# Altium project ECGHLSound_Layout_V2.PrjPcb
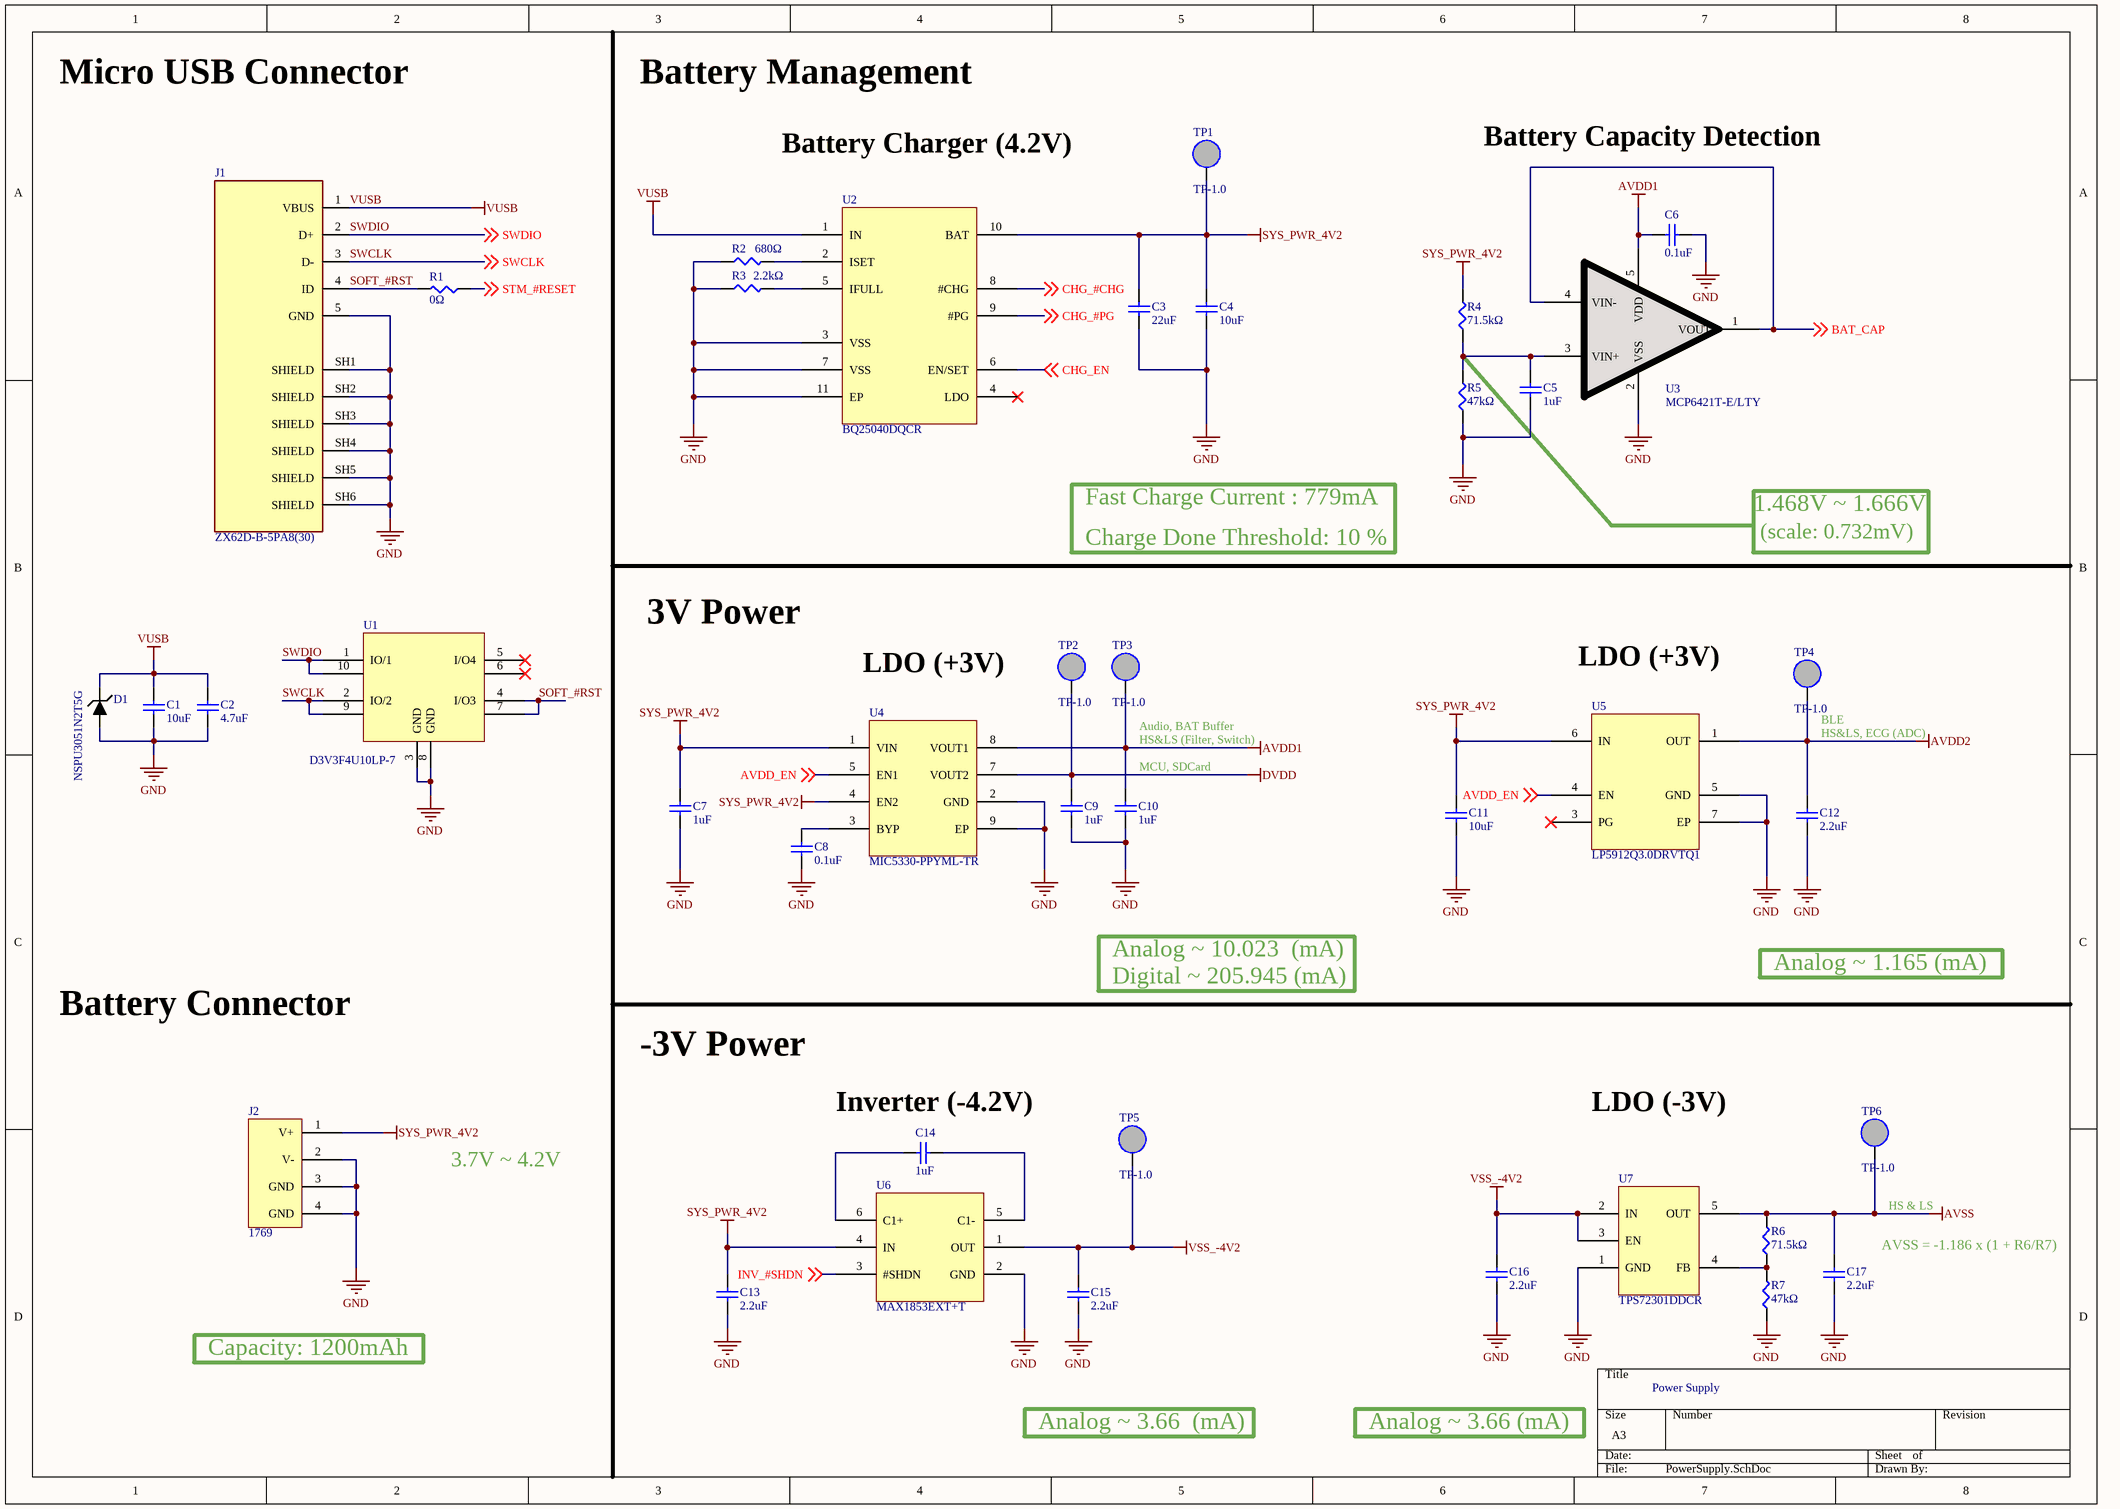
[diagram p0: PowerSupply.SchDoc]
7 sheets, 184 parts. Net scope: flat (ports and power ports of the same name join across sheets).
Board file: ECG_HS_LS.PcbDoc
Sheets:
  PowerSupply.SchDoc
  HeartSound_LungSound.SchDoc
  Audio.SchDoc
  ECG.SchDoc
  Microcontroller.SchDoc
  Peripherals.SchDoc
  Module.SchDoc

## Sheet PowerSupply.SchDoc
size A3; SheetNumber: 1; SheetTotal: 7

### Parts
C1  10uF  [0603]
C2  4.7uF  [0603]
C3  22uF  [0603]
C4  10uF  [0603]
C5  1uF  [0402]
C6  0.1uF  [0402]
C7  1uF  [0402]
C8  0.1uF  [0402]
C9  1uF  [0402]
C10  1uF  [0402]
C11  10uF  [0603]
C12  2.2uF  [0402]
C13  2.2uF  [0402]
C14  1uF  [0402]
C15  2.2uF  [0402]
C16  2.2uF  [0402]
C17  2.2uF  [0402]
D1  NSPU3051N2T5G  [X2DFN-2(0.73-0.6x1.0x0.37)]
J1  ZX62D-B-5PA8(30)  [HIROSE_ZX62D-B-5PA8(30)]
J2  1769  [JST-PH 2-Pin]
R1  0Ω  [0402]
R2  680Ω  [0402]
R3  2.2kΩ  [0402]
R4  71.5kΩ  [0402]
R5  47kΩ  [0402]
R6  71.5kΩ  [0402]
R7  47kΩ  [0402]
TP1  TP-1.0  [Testpoint]  (no BOM)
TP2  TP-1.0  [Testpoint]  (no BOM)
TP3  TP-1.0  [Testpoint]  (no BOM)
TP4  TP-1.0  [Testpoint]  (no BOM)
TP5  TP-1.0  [Testpoint]  (no BOM)
TP6  TP-1.0  [Testpoint]  (no BOM)
U1  D3V3F4U10LP-7  [UDFN2510-10(0.5-1.0x2.5x0.575)]
U2  BQ25040DQCR  [WSON-10(0.5-2.0x3.0x0.8)]
U3  MCP6421T-E/LTY  [SC-70-5]
U4  MIC5330-PPYML-TR  [VFDFN-8]
U5  LP5912Q3.0DRVTQ1  [WSON-6]
U6  MAX1853EXT+T  [SC70-6]
U7  TPS72301DDCR  [SOT-23-5]

### Nets
AVDD1: C6.2 C10.2 TP3.1 U3.5(VDD) U4.8(VOUT1)
AVDD2: C12.2 TP4.1 U5.1(OUT)
AVSS: C17.2 R6.2 TP6.1 U7.5(OUT)
DVDD: C9.2 TP2.1 U4.7(VOUT2)
GND: C1.1 C2.1 C3.1 C4.1 C5.1 C6.1 C7.1 C8.1 C9.1 C10.1 C11.1 C12.1 C13.1 C15.1 C16.1 C17.1 D1.2(ANODE) J1.5(GND) J1.SH1(SHIELD) J1.SH2(SHIELD) J1.SH3(SHIELD) J1.SH4(SHIELD) J1.SH5(SHIELD) J1.SH6(SHIELD) J2.2(V-) J2.3(GND) J2.4(GND) R2.1 R3.1 R5.1 R7.1 U1.3(GND) U1.8(GND) U2.3(VSS) U2.7(VSS) U2.11(EP) U3.2(VSS) U4.2(GND) U4.9(EP) U5.5(GND) U5.7(EP) U6.2(GND) U7.1(GND)
SYS_PWR_4V2: C3.2 C4.2 C7.2 C11.2 C13.2 J2.1(V+) R4.2 TP1.1 U2.10(BAT) U4.1(VIN) U4.4(EN2) U5.6(IN) U6.4(IN)
VSS_-4V2: C15.2 C16.2 TP5.1 U6.1(OUT) U7.2(IN) U7.3(EN)
VUSB: C1.2 C2.2 D1.1(CATHODE) J1.1(VBUS) U2.1(IN)
AVDD_EN: U4.5(EN1) U5.4(EN) ; off-sheet AVDD_EN
BAT_CAP: U3.1(VOUT) U3.4(VIN-) ; off-sheet BAT_CAP
CHG_#CHG: U2.8(#CHG) ; off-sheet CHG_#CHG
CHG_#PG: U2.9(#PG) ; off-sheet CHG_#PG
CHG_EN: U2.6(EN/SET) ; off-sheet CHG_EN
INV_#SHDN: U6.3(#SHDN) ; off-sheet INV_#SHDN
SOFT_#RST: J1.4(ID) R1.2 U1.4(I/O3) U1.7
STM_#RESET: R1.1 ; off-sheet STM_#RESET
SWCLK: J1.3(D-) U1.2(IO/2) U1.9 ; off-sheet SWCLK
SWDIO: J1.2(D+) U1.1(IO/1) U1.10 ; off-sheet SWDIO
NetC5_2: C5.2 R4.1 R5.2 U3.3(VIN+)
NetC8_2: C8.2 U4.3(BYP)
NetC14_1: C14.1 U6.6(C1+)
NetC14_2: C14.2 U6.5(C1-)
NetR2_2: R2.2 U2.2(ISET)
NetR3_2: R3.2 U2.5(IFULL)
NetR6_1: R6.1 R7.2 U7.4(FB)

Not connected (* = marked no-connect by the designer): U1 5(I/O4)* 6*; U2 4(LDO)*; U5 3(PG)*

### Notes on the sheet
- Micro USB Connector
- Battery Management
- Battery Charger (4.2V)
- Battery Capacity Detection
- Fast Charge Current : 779mA
- 1.468V ~ 1.666V
- Charge Done Threshold: 10 %
- (scale: 0.732mV)
- 3V Power
- LDO (+3V)
- (near TP4) BLE
- (near TP3) Audio, BAT Buffer
- (near C10) MCU, SDCard
- HS&LS (Filter, Switch)
- (near TP4) HS&LS, ECG (ADC)
- Digital ~ 205.945 (mA)
- Analog ~ 10.023  (mA)
- Analog ~ 1.165 (mA)
- Battery Connector
- -3V Power
- (near C14) Inverter (-4.2V)
- LDO (-3V)
- 3.7V ~ 4.2V
- (near C17) AVSS = -1.186 x (1 + R6/R7)
- HS & LS
- Capacity: 1200mAh
- Power Supply
- Analog ~ 3.66  (mA)
- Analog ~ 3.66 (mA)

### Library data of the parts
C1-C4 C11 = 0603: MLCC-0603
C5-C10 C12-C17 = 0402: MLCC-0402
D1 = NSPU3051N2T5G: 0016-11-ESD-01-D3V3F4U10LP-7; AuthorBy: yjlab
J1 = ZX62D-B-5PA8(30): USB Connectors 5P RECEPTACLE
J2 = 1769: Battery Connector, JST-PH 2 Pin
R1-R7 = 0402: Resistor_SMD_0402; AuthorBy: yjlab
TP1-TP6 = Testpoint
U1 = D3V3F4U10LP-7: 0017-11-ESD-01-D3V3F4U10LP-7; AuthorBy: yjlab
U2 = BQ25040DQCR: 0001-07-BAC-01-BQ25040DQCR; AuthorBy: yjlab
U3 = MCP6421T-E/LTY: 4.4 µA/Amplifier, 90 kHz Op Amp
U4 = MIC5330-PPYML-TR: Voltage Regulators Dual 300mA LDO, 2 Output: (3V, 3V)
U5 = LP5912Q3.0DRVTQ1: LDO Voltage Regulators Automotive 500-mA, low-noise, low-IQ, low-dropout voltage regulator with reverse current protection
U6 = MAX1853EXT+T: Switching Voltage Regulators SC70 Inverting Charge Pumps with Shutdown, Switching Frequency 200kHz
U7 = TPS72301DDCR: Negative Output LDO, Adjustable Output

## Sheet HeartSound_LungSound.SchDoc
size A3; SheetNumber: 2; SheetTotal: 7
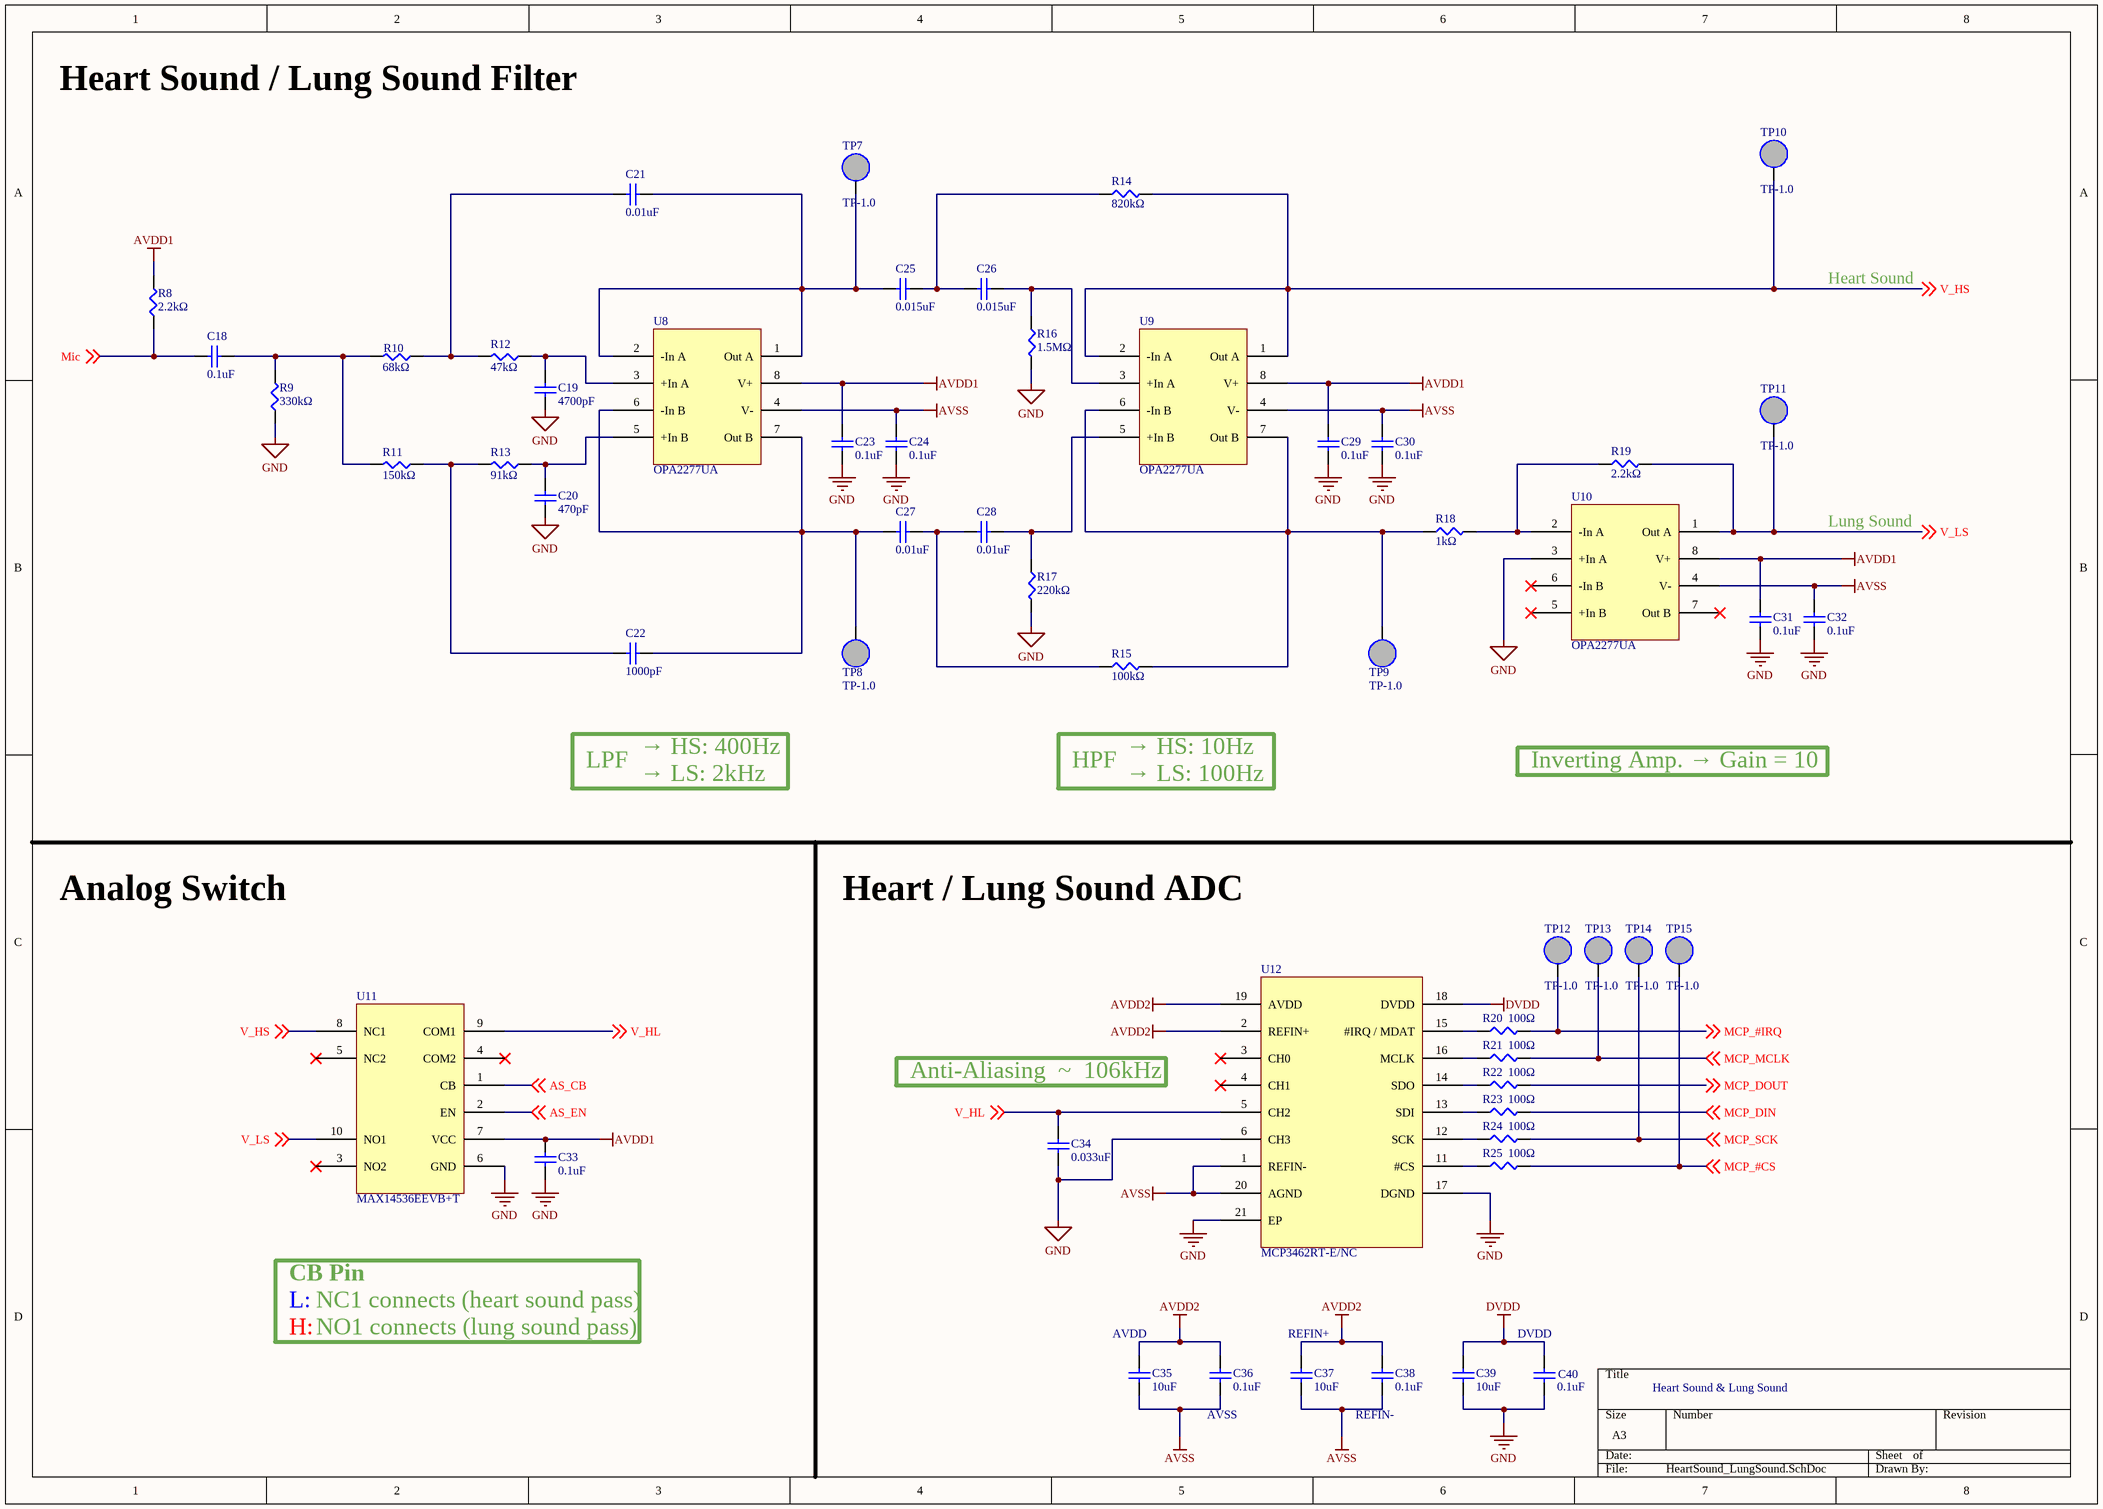
[diagram p1: HeartSound_LungSound.SchDoc]

### Parts
C18  0.1uF  [0402]
C19  4700pF  [0402]
C20  470pF  [0402]
C21  0.01uF  [0402]
C22  1000pF  [0402]
C23  0.1uF  [0402]
C24  0.1uF  [0402]
C25  0.015uF  [0402]
C26  0.015uF  [0402]
C27  0.01uF  [0402]
C28  0.01uF  [0402]
C29  0.1uF  [0402]
C30  0.1uF  [0402]
C31  0.1uF  [0402]
C32  0.1uF  [0402]
C33  0.1uF  [0402]
C34  0.033uF  [0402]
C35  10uF  [0603]
C36  0.1uF  [0402]
C37  10uF  [0603]
C38  0.1uF  [0402]
C39  10uF  [0603]
C40  0.1uF  [0402]
R8  2.2kΩ  [0402]
R9  330kΩ  [0402]
R10  68kΩ  [0402]
R11  150kΩ  [0402]
R12  47kΩ  [0402]
R13  91kΩ  [0402]
R14  820kΩ  [0402]
R15  100kΩ  [0402]
R16  1.5MΩ  [0402]
R17  220kΩ  [0402]
R18  1kΩ  [0402]
R19  2.2kΩ  [0402]
R20  100Ω  [0402]
R21  100Ω  [0402]
R22  100Ω  [0402]
R23  100Ω  [0402]
R24  100Ω  [0402]
R25  100Ω  [0402]
TP7  TP-1.0  [Testpoint]  (no BOM)
TP8  TP-1.0  [Testpoint]  (no BOM)
TP9  TP-1.0  [Testpoint]  (no BOM)
TP10  TP-1.0  [Testpoint]  (no BOM)
TP11  TP-1.0  [Testpoint]  (no BOM)
TP12  TP-1.0  [Testpoint]  (no BOM)
TP13  TP-1.0  [Testpoint]  (no BOM)
TP14  TP-1.0  [Testpoint]  (no BOM)
TP15  TP-1.0  [Testpoint]  (no BOM)
U8  OPA2277UA  [SOIC-8]
U9  OPA2277UA  [SOIC-8]
U10  OPA2277UA  [SOIC-8]
U11  MAX14536EEVB+T  [ULTRA-TQFN-10]
U12  MCP3462RT-E/NC  [UQFN-20]

### Nets
AVDD1: C23.1 C29.2 C31.2 C33.2 R8.2 U8.8(V+) U9.8(V+) U10.8(V+) U11.7(VCC)
AVDD2: C35.2 C36.2 C37.1 C38.2 U12.2(REFIN+) U12.19(AVDD)
AVSS: C24.2 C30.1 C32.1 C35.1 C36.1 C37.2 C38.1 U8.4(V-) U9.4(V-) U10.4(V-) U12.1(REFIN-) U12.20(AGND)
DVDD: C39.2 C40.2 U12.18(DVDD)
GND: C19.2 C20.2 C23.2 C24.1 C29.1 C30.2 C31.1 C32.2 C33.1 C34.2 C39.1 C40.1 R9.1 R16.2 R17.2 U10.3(+In_A) U11.6(GND) U12.6(CH3) U12.17(DGND) U12.21(EP)
AS_CB: U11.1(CB) ; off-sheet AS_CB
AS_EN: U11.2(EN) ; off-sheet AS_EN
MCP_#CS: R25.2 TP15.1 ; off-sheet MCP_#CS
MCP_#IRQ: R20.2 TP12.1 ; off-sheet MCP_#IRQ
MCP_DIN: R23.2 ; off-sheet MCP_DIN
MCP_DOUT: R22.2 ; off-sheet MCP_DOUT
MCP_MCLK: R21.2 TP13.1 ; off-sheet MCP_MCLK
MCP_SCK: R24.2 TP14.1 ; off-sheet MCP_SCK
Mic: C18.1 R8.1 ; off-sheet Mic
V_HL: C34.1 U11.9(COM1) U12.5(CH2) ; off-sheet V_HL
V_HS: R14.2 TP10.1 U9.1(Out_A) U9.2(-In_A) U11.8(NC1) ; off-sheet V_HS
V_LS: R19.2 TP11.1 U10.1(Out_A) U11.10(NO1) ; off-sheet V_LS
NetC18_2: C18.2 R9.2 R10.2 R11.2
NetC19_1: C19.1 R12.1 U8.3(+In_A)
NetC20_1: C20.1 R13.1 U8.5(+In_B)
NetC21_1: C21.1 C25.2 TP7.1 U8.1(Out_A) U8.2(-In_A)
NetC21_2: C21.2 R10.1 R12.2
NetC22_1: C22.1 R11.1 R13.2
NetC22_2: C22.2 C27.2 TP8.1 U8.6(-In_B) U8.7(Out_B)
NetC25_1: C25.1 C26.2 R14.1
NetC26_1: C26.1 R16.1 U9.3(+In_A)
NetC27_1: C27.1 C28.2 R15.1
NetC28_1: C28.1 R17.1 U9.5(+In_B)
NetR15_2: R15.2 R18.1 TP9.1 U9.6(-In_B) U9.7(Out_B)
NetR18_2: R18.2 R19.1 U10.2(-In_A)
NetR20_1: R20.1 U12.15(#IRQ_/_MDAT)
NetR21_1: R21.1 U12.16(MCLK)
NetR22_1: R22.1 U12.14(SDO)
NetR23_1: R23.1 U12.13(SDI)
NetR24_1: R24.1 U12.12(SCK)
NetR25_1: R25.1 U12.11(#CS)

Not connected (* = marked no-connect by the designer): U10 5(+In_B)* 6(-In_B)* 7(Out_B)*; U11 3(NO2)* 4(COM2)* 5(NC2)*; U12 3(CH0)* 4(CH1)*

### Notes on the sheet
- Heart Sound / Lung Sound Filter
- Heart Sound
- Lung Sound
- LPF
- → LS: 2kHz
- → HS: 400Hz
- HPF
- → LS: 100Hz
- → HS: 10Hz
- Inverting Amp. → Gain = 10
- Analog Switch
- Heart / Lung Sound ADC
- Anti-Aliasing  ~  106kHz
- CB Pin
- L:
- NC1 connects (heart sound pass)
- H:
- NO1 connects (lung sound pass)
- (near C35) AVDD
- (near C37) REFIN+
- (near C40) DVDD
- Heart Sound & Lung Sound
- (near C36) AVSS
- (near C38) REFIN-

### Library data of the parts
C18-C34 C36 C38 C40 = 0402: MLCC-0402
C35 C37 C39 = 0603: MLCC-0603
R8-R25 = 0402: Resistor_SMD_0402; AuthorBy: yjlab
TP7-TP15 = Testpoint
U8-U10 = OPA2277UA: High Precision OP Amp, 2 Channel
U11 = MAX14536EEVB+T: Analog Switch, 0.135 (Ω) On-Resistence
U12 = MCP3462RT-E/NC: Delta-to-Sigma ADC, 16 Bit, 2 Channel

## Sheet Audio.SchDoc
size A4; SheetNumber: 3; SheetTotal: 7
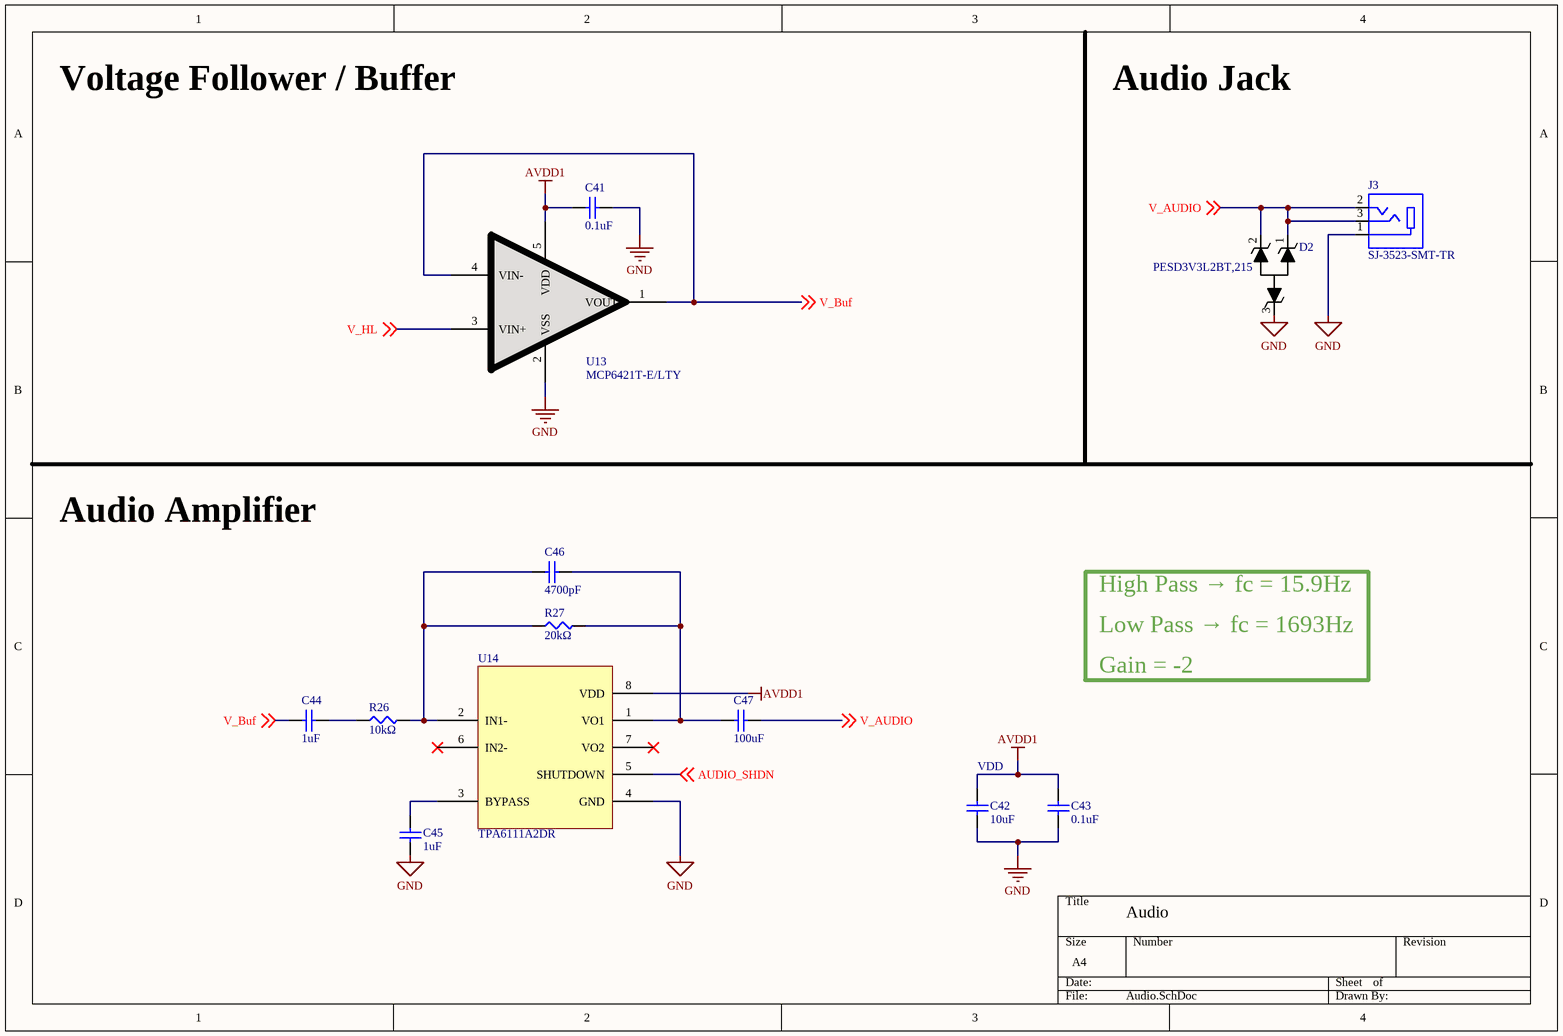
[diagram p2: Audio.SchDoc]

### Parts
C41  0.1uF  [0402]
C42  10uF  [0603]
C43  0.1uF  [0402]
C44  1uF  [0402]
C45  1uF  [0402]
C46  4700pF  [0402]
C47  100uF  [1206]
D2  PESD3V3L2BT,215  [SOT-23-3]
J3  SJ-3523-SMT-TR  [CUI_SJ-3523-SMT-TR]
R26  10kΩ  [0402]
R27  20kΩ  [0402]
U13  MCP6421T-E/LTY  [SC-70-5]
U14  TPA6111A2DR  [SOIC-8]

### Nets
AVDD1: C41.1 C42.2 C43.1 U13.5(VDD) U14.8(VDD)
GND: C41.2 C42.1 C43.2 C45.1 D2.3 J3.1 U13.2(VSS) U14.4(GND)
AUDIO_SHDN: U14.5(SHUTDOWN) ; off-sheet AUDIO_SHDN
V_AUDIO: C47.2 D2.1 D2.2 J3.2 J3.3 ; off-sheet V_AUDIO
V_Buf: C44.1 U13.1(VOUT) U13.4(VIN-) ; off-sheet V_Buf
V_HL: U13.3(VIN+) ; off-sheet V_HL
NetC44_2: C44.2 R26.1
NetC45_2: C45.2 U14.3(BYPASS)
NetC46_1: C46.1 R26.2 R27.1 U14.2(IN1-)
NetC46_2: C46.2 C47.1 R27.2 U14.1(VO1)

Not connected (* = marked no-connect by the designer): U14 6(IN2-)* 7(VO2)*

### Notes on the sheet
- Voltage Follower / Buffer
- Audio Jack
- Audio Amplifier
- High Pass → fc = 15.9Hz
- Low Pass → fc = 1693Hz
- Gain = -2
- (near C42) VDD
- Audio

### Library data of the parts
C41 C43-C46 = 0402: MLCC-0402
C42 = 0603: MLCC-0603
C47 = 1206: MLCC-1206
D2 = PESD3V3L2BT,215: ESD Suppressors / TVS Diodes, 2 Channl. Breakdown 6.4V, Clamping Voltage 8V
J3 = SJ-3523-SMT-TR: 3.5 mm, Stereo, Right Angle, Surface Mount _SMT_, Audio Jack Connector; MF: CUI Devices; Package: LGA-10 STMicroelectronics; CUI_purchase_URL: https://www.cuidevices.com/product/interconnect/connectors/audio-connectors/jacks/sj-352x-smt-series?utm_source=snapeda.com&utm_medium=referral&utm_campaign=snapedaBOM; Value: *; Price: None; MP: SJ-3523-SMT-TR; Availability: Unavailable; SnapEDA_Link: https://www.snapeda.com/parts/SJ-3523-SMT-TR/CUI%20Devices/view-part/251570/?ref=snap
R26 R27 = 0402: Resistor_SMD_0402; AuthorBy: yjlab
U13 = MCP6421T-E/LTY: 4.4 µA/Amplifier, 90 kHz Op Amp
U14 = TPA6111A2DR: Audio Power Amp

## Sheet ECG.SchDoc
size A4; SheetNumber: 4; SheetTotal: 7
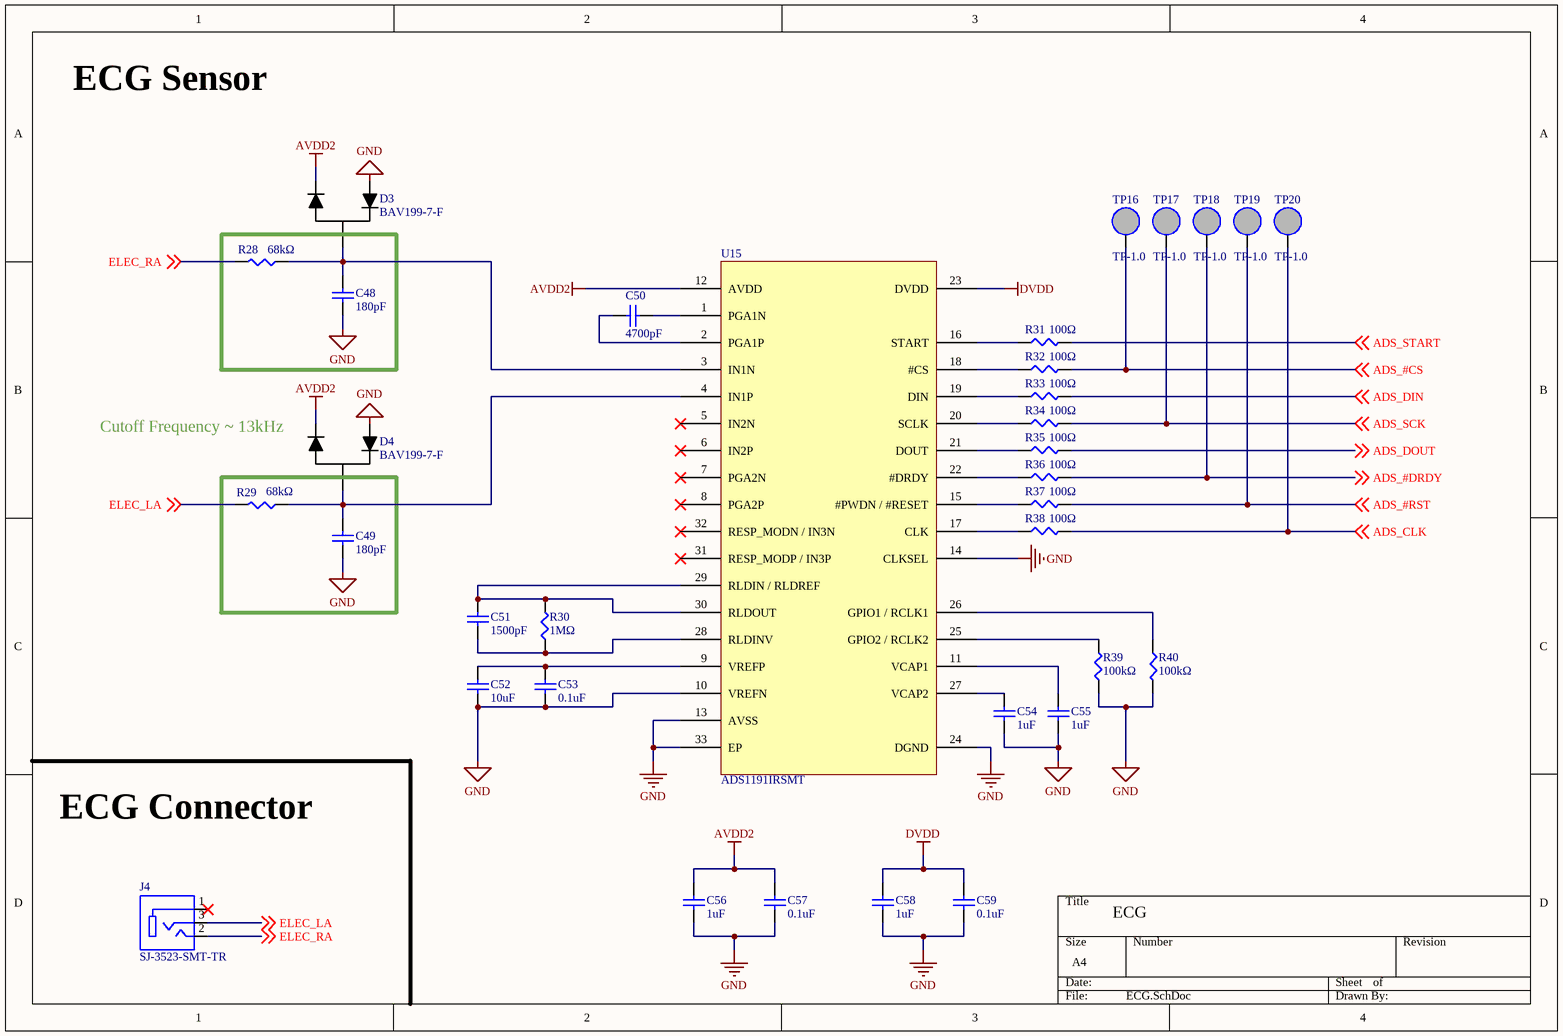
[diagram p3: ECG.SchDoc]

### Parts
C48  180pF  [0402]
C49  180pF  [0402]
C50  4700pF  [0402]
C51  1500pF  [0402]
C52  10uF  [0603]
C53  0.1uF  [0402]
C54  1uF  [0402]
C55  1uF  [0402]
C56  1uF  [0402]
C57  0.1uF  [0402]
C58  1uF  [0402]
C59  0.1uF  [0402]
D3  BAV199-7-F  [SOT-23]
D4  BAV199-7-F  [SOT-23]
J4  SJ-3523-SMT-TR  [CUI_SJ-3523-SMT-TR]
R28  68kΩ  [0402]
R29  68kΩ  [0402]
R30  1MΩ  [0402]
R31  100Ω  [0402]
R32  100Ω  [0402]
R33  100Ω  [0402]
R34  100Ω  [0402]
R35  100Ω  [0402]
R36  100Ω  [0402]
R37  100Ω  [0402]
R38  100Ω  [0402]
R39  100kΩ  [0402]
R40  100kΩ  [0402]
TP16  TP-1.0  [Testpoint]  (no BOM)
TP17  TP-1.0  [Testpoint]  (no BOM)
TP18  TP-1.0  [Testpoint]  (no BOM)
TP19  TP-1.0  [Testpoint]  (no BOM)
TP20  TP-1.0  [Testpoint]  (no BOM)
U15  ADS1191IRSMT  [VQFN-32]

### Nets
AVDD2: C56.2 C57.2 D3.3(Cathode) D4.3(Cathode) U15.12(AVDD)
DVDD: C58.2 C59.2 U15.23(DVDD)
GND: C48.1 C49.1 C52.1 C53.1 C54.2 C55.2 C56.1 C57.1 C58.1 C59.1 D3.2(Anode) D4.2(Anode) R39.1 R40.2 U15.10(VREFN) U15.13(AVSS) U15.14(CLKSEL) U15.24(DGND) U15.33(EP)
ADS_#CS: R32.2 TP16.1 ; off-sheet ADS_#CS
ADS_#DRDY: R36.2 TP18.1 ; off-sheet ADS_#DRDY
ADS_#RST: R37.2 TP19.1 ; off-sheet ADS_#RST
ADS_CLK: R38.2 TP20.1 ; off-sheet ADS_CLK
ADS_DIN: R33.2 ; off-sheet ADS_DIN
ADS_DOUT: R35.2 ; off-sheet ADS_DOUT
ADS_SCK: R34.2 TP17.1 ; off-sheet ADS_SCK
ADS_START: R31.2 ; off-sheet ADS_START
ELEC_LA: J4.3 R29.2 ; off-sheet ELEC_LA
ELEC_RA: J4.2 R28.2 ; off-sheet ELEC_RA
NetC48_2: C48.2 D3.1(Common) R28.1 U15.3(IN1N)
NetC49_2: C49.2 D4.1(Common) R29.1 U15.4(IN1P)
NetC50_1: C50.1 U15.2(PGA1P)
NetC50_2: C50.2 U15.1(PGA1N)
NetC51_1: C51.1 R30.1 U15.28(RLDINV)
NetC51_2: C51.2 R30.2 U15.29(RLDIN_/_RLDREF) U15.30(RLDOUT)
NetC52_2: C52.2 C53.2 U15.9(VREFP)
NetC54_1: C54.1 U15.27(VCAP2)
NetC55_1: C55.1 U15.11(VCAP1)
NetR31_1: R31.1 U15.16(START)
NetR32_1: R32.1 U15.18(#CS)
NetR33_1: R33.1 U15.19(DIN)
NetR34_1: R34.1 U15.20(SCLK)
NetR35_1: R35.1 U15.21(DOUT)
NetR36_1: R36.1 U15.22(#DRDY)
NetR37_1: R37.1 U15.15(#PWDN_/_#RESET)
NetR38_1: R38.1 U15.17(CLK)
NetR39_2: R39.2 U15.25(GPIO2_/_RCLK2)
NetR40_1: R40.1 U15.26(GPIO1_/_RCLK1)

Not connected (* = marked no-connect by the designer): J4 1*; U15 5(IN2N)* 6(IN2P)* 7(PGA2N)* 8(PGA2P)* 31(RESP_MODP_/_IN3P)* 32(RESP_MODN_/_IN3N)*

### Notes on the sheet
- ECG Sensor
- (near D4) Cutoff Frequency ~ 13kHz
- ECG Connector
- ECG

### Library data of the parts
C48-C51 C53-C59 = 0402: MLCC-0402
C52 = 0603: MLCC-0603
D3 D4 = BAV199-7-F: Dual Surface Mount Low Leakage Diode
J4 = SJ-3523-SMT-TR: as J3 on sheet Audio; Package: LGA-10 STMicroelectronics; CUI_purchase_URL: https://www.cuidevices.com/product/interconnect/connectors/audio-connectors/jacks/sj-352x-smt-series?utm_source=snapeda.com&utm_medium=referral&utm_campaign=snapedaBOM; Value: *; Price: None; MP: SJ-3523-SMT-TR; Availability: Unavailable; SnapEDA_Link: https://www.snapeda.com/parts/SJ-3523-SMT-TR/CUI%20Devices/view-part/251570/?ref=snap
R28-R40 = 0402: Resistor_SMD_0402; AuthorBy: yjlab
TP16-TP20 = Testpoint
U15 = ADS1191IRSMT: Biopotential Measurement ADC, 2 Channel, 16 Bit

## Sheet Microcontroller.SchDoc
size A3; SheetNumber: 5; SheetTotal: 7
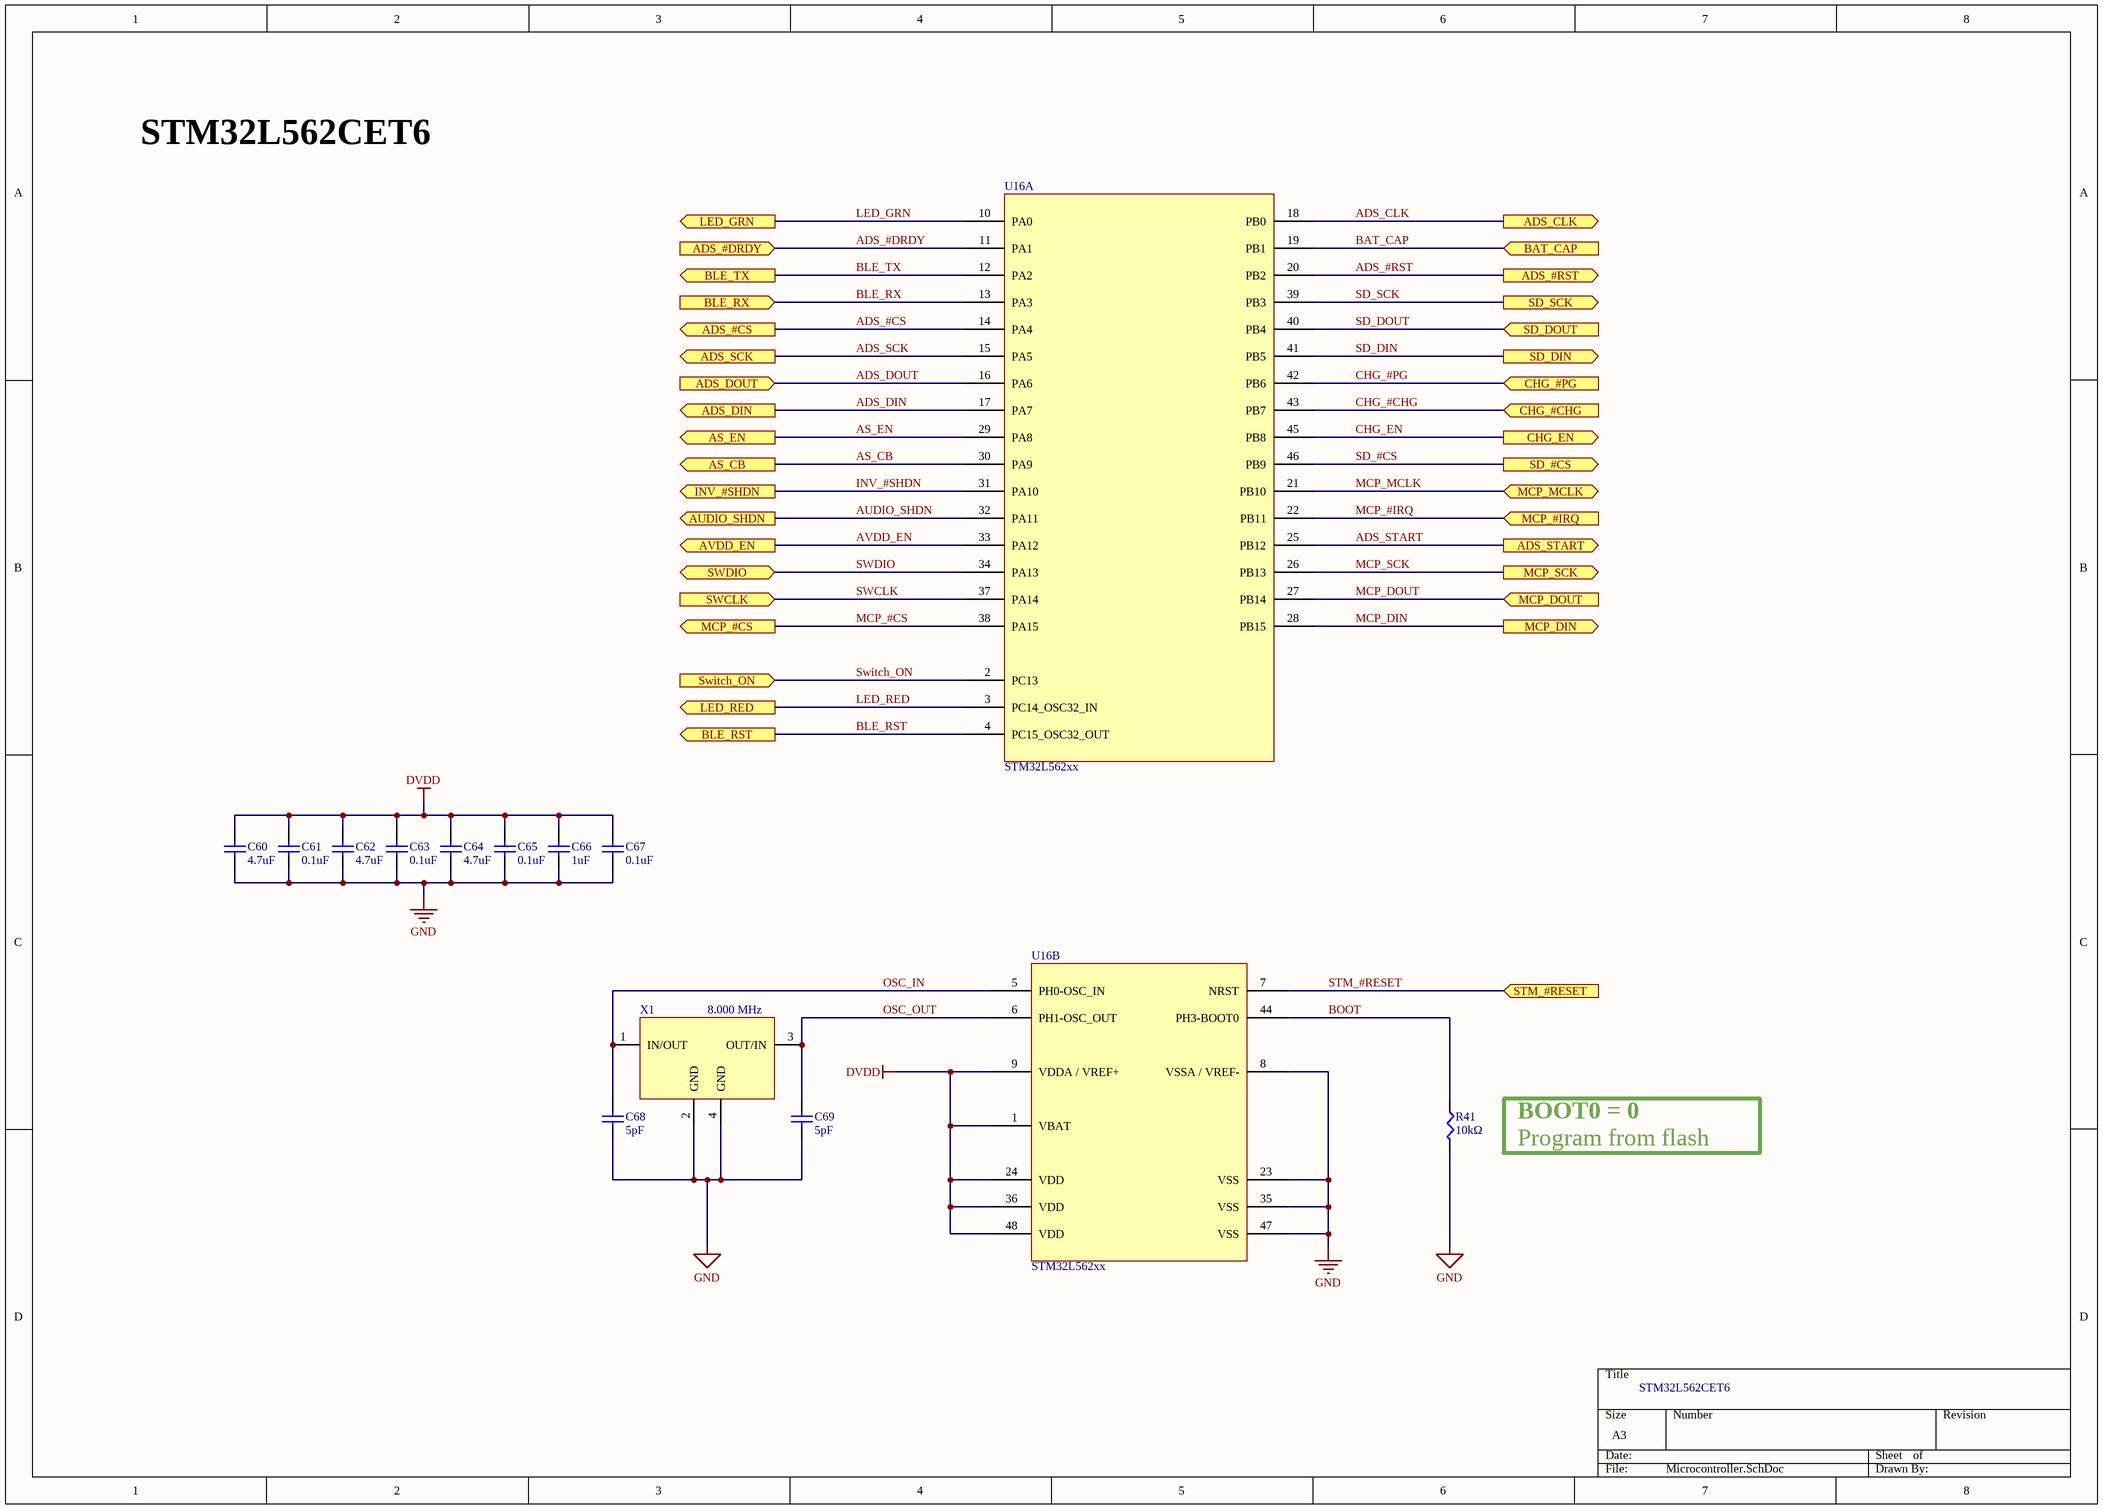
[diagram p4: Microcontroller.SchDoc]

### Parts
C60  4.7uF  [0603]
C61  0.1uF  [0402]
C62  4.7uF  [0603]
C63  0.1uF  [0402]
C64  4.7uF  [0603]
C65  0.1uF  [0402]
C66  1uF  [0402]
C67  0.1uF  [0402]
C68  5pF  [0402]
C69  5pF  [0402]
R41  10kΩ  [0402]
U16  STM32L562xx  [LQFP48]  (parts A,B of 2)
X1  8.000 MHz  [SMD-4]

### Ports
ADS_#CS (out), ADS_#DRDY (in), ADS_#RST (out), ADS_CLK (out), ADS_DIN (out), ADS_DOUT (in), ADS_SCK (out), ADS_START (out), AS_CB (out), AS_EN (out), AUDIO_SHDN (out), AVDD_EN (out), BAT_CAP (in), BLE_RST (out), BLE_RX (in), BLE_TX (out), CHG_#CHG (in), CHG_#PG (in), CHG_EN (out), INV_#SHDN (out), LED_GRN (out), LED_RED (out), MCP_#CS (out), MCP_#IRQ (in), MCP_DIN (out), MCP_DOUT (in), MCP_MCLK (bidir), MCP_SCK (out), SD_#CS (out), SD_DIN (out), SD_DOUT (in), SD_SCK (out), STM_#RESET (in), SWCLK (in), SWDIO (bidir), Switch_ON (in)

### Nets
DVDD: C60.2 C61.2 C62.2 C63.2 C64.2 C65.2 C66.2 C67.2 U16.1(VBAT) U16.9(VDDA_/_VREF+) U16.24(VDD) U16.36(VDD) U16.48(VDD)
GND: C60.1 C61.1 C62.1 C63.1 C64.1 C65.1 C66.1 C67.1 C68.1 C69.1 R41.2 U16.8(VSSA_/_VREF-) U16.23(VSS) U16.35(VSS) U16.47(VSS) X1.2(GND) X1.4(GND)
ADS_#CS: U16.14(PA4) ; port ADS_#CS
ADS_#DRDY: U16.11(PA1) ; port ADS_#DRDY
ADS_#RST: U16.20(PB2) ; port ADS_#RST
ADS_CLK: U16.18(PB0) ; port ADS_CLK
ADS_DIN: U16.17(PA7) ; port ADS_DIN
ADS_DOUT: U16.16(PA6) ; port ADS_DOUT
ADS_SCK: U16.15(PA5) ; port ADS_SCK
ADS_START: U16.25(PB12) ; port ADS_START
AS_CB: U16.30(PA9) ; port AS_CB
AS_EN: U16.29(PA8) ; port AS_EN
AUDIO_SHDN: U16.32(PA11) ; port AUDIO_SHDN
AVDD_EN: U16.33(PA12) ; port AVDD_EN
BAT_CAP: U16.19(PB1) ; port BAT_CAP
BLE_RST: U16.4(PC15_OSC32_OUT) ; port BLE_RST
BLE_RX: U16.13(PA3) ; port BLE_RX
BLE_TX: U16.12(PA2) ; port BLE_TX
BOOT: R41.1 U16.44(PH3-BOOT0)
CHG_#CHG: U16.43(PB7) ; port CHG_#CHG
CHG_#PG: U16.42(PB6) ; port CHG_#PG
CHG_EN: U16.45(PB8) ; port CHG_EN
INV_#SHDN: U16.31(PA10) ; port INV_#SHDN
LED_GRN: U16.10(PA0) ; port LED_GRN
LED_RED: U16.3(PC14_OSC32_IN) ; port LED_RED
MCP_#CS: U16.38(PA15) ; port MCP_#CS
MCP_#IRQ: U16.22(PB11) ; port MCP_#IRQ
MCP_DIN: U16.28(PB15) ; port MCP_DIN
MCP_DOUT: U16.27(PB14) ; port MCP_DOUT
MCP_MCLK: U16.21(PB10) ; port MCP_MCLK
MCP_SCK: U16.26(PB13) ; port MCP_SCK
OSC_IN: C68.2 U16.5(PH0-OSC_IN) X1.1(IN/OUT)
OSC_OUT: C69.2 U16.6(PH1-OSC_OUT) X1.3(OUT/IN)
SD_#CS: U16.46(PB9) ; port SD_#CS
SD_DIN: U16.41(PB5) ; port SD_DIN
SD_DOUT: U16.40(PB4) ; port SD_DOUT
SD_SCK: U16.39(PB3) ; port SD_SCK
STM_#RESET: U16.7(NRST) ; port STM_#RESET
SWCLK: U16.37(PA14) ; port SWCLK
SWDIO: U16.34(PA13) ; port SWDIO
Switch_ON: U16.2(PC13) ; port Switch_ON

### Notes on the sheet
- STM32L562CET6
- BOOT0 = 0
- Program from flash

### Library data of the parts
C60 C62 C64 = 0603: MLCC-0603
C61 C63 C65-C69 = 0402: MLCC-0402
R41 = 0402: Resistor_SMD_0402; AuthorBy: yjlab
U16 = STM32L562xx: STM32, 32 Bit MCU, 48 Pin, Arm Cortex-M33, 512 (kB) Flash, 256 (kB) SRAM
X1 = ECS-80-10-30B-CKM-TR: Crystals ECX-53B 8.000 MHz 10 pF

## Sheet Peripherals.SchDoc
size A4; SheetNumber: 6; SheetTotal: 7
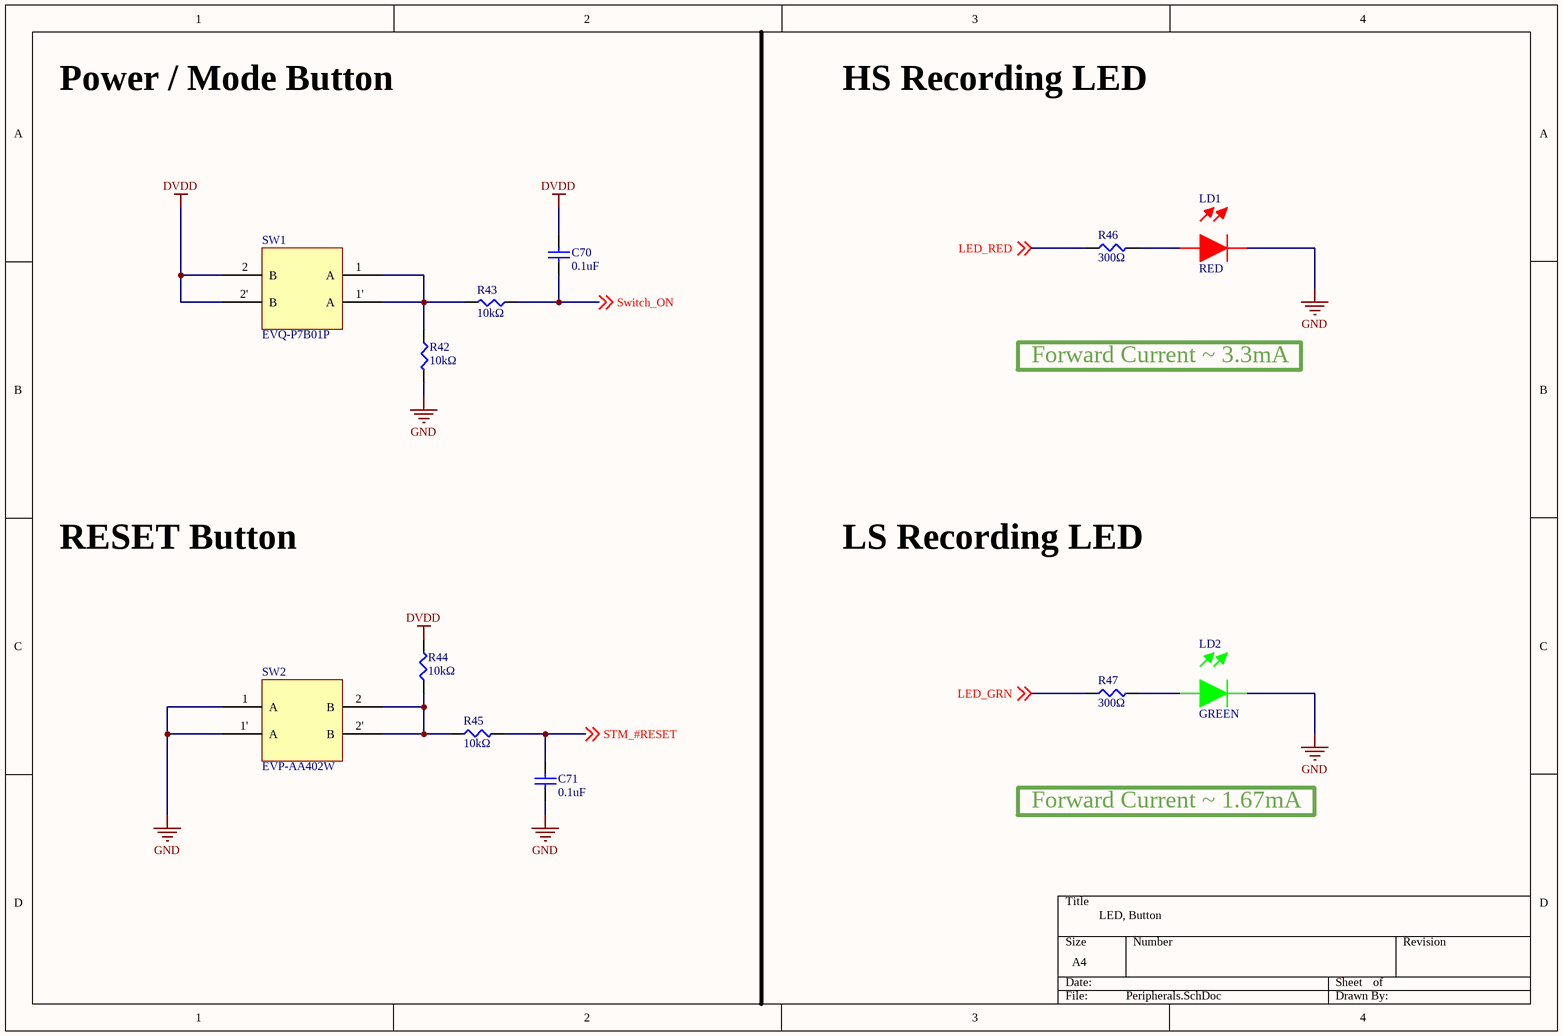
[diagram p5: Peripherals.SchDoc]

### Parts
C70  0.1uF  [0402]
C71  0.1uF  [0402]
LD1  RED  [RED]
LD2  GREEN  [GREEN]
R42  10kΩ  [0402]
R43  10kΩ  [0402]
R44  10kΩ  [0402]
R45  10kΩ  [0402]
R46  300Ω  [0402]
R47  300Ω  [0402]
SW1  EVQ-P7B01P  [2.2N]
SW2  EVP-AA402W  [2.4N]

### Nets
DVDD: C70.1 R44.2 SW1.2(B) SW1.2'(B)
GND: C71.1 LD1.C LD2.C R42.2 SW2.1(A) SW2.1'(A)
LED_GRN: R47.1 ; off-sheet LED_GRN
LED_RED: R46.1 ; off-sheet LED_RED
STM_#RESET: C71.2 R45.2 ; off-sheet STM_#RESET
Switch_ON: C70.2 R43.1 ; off-sheet Switch_ON
NetLD1_A: LD1.A R46.2
NetLD2_A: LD2.A R47.2
NetR42_1: R42.1 R43.2 SW1.1(A) SW1.1'(A)
NetR44_1: R44.1 R45.1 SW2.2(B) SW2.2'(B)

### Notes on the sheet
- Power / Mode Button
- HS Recording LED
- Forward Current ~ 3.3mA
- RESET Button
- LS Recording LED
- Forward Current ~ 1.67mA
- LED, Button

### Library data of the parts
C70 C71 = 0402: MLCC-0402
R42-R47 = 0402: Resistor_SMD_0402; AuthorBy: yjlab
SW1 = EVQ-P7B01P: Light Touch Switch, Right Angle, Operating Force 2.2 (N)
SW2 = EVP-AA402W: Lite Touch Switch, Vertical, Operating Force 2.4(N)

## Sheet Module.SchDoc
size A4; SheetNumber: 7; SheetTotal: 7
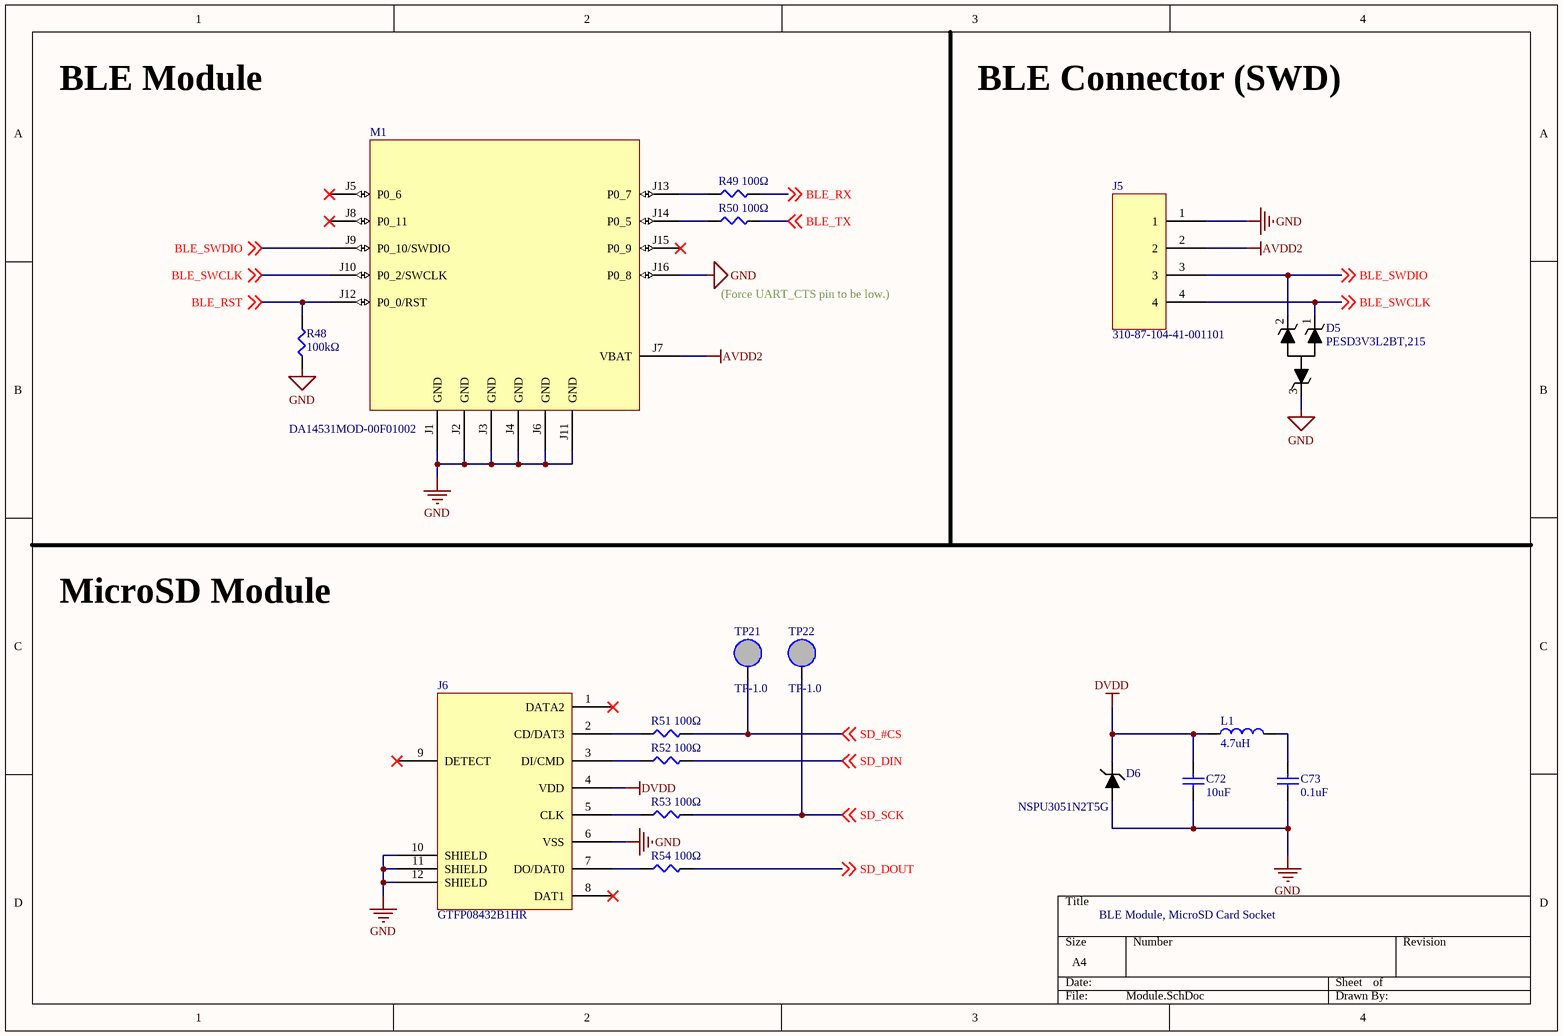
[diagram p6: Module.SchDoc]

### Parts
C72  10uF  [0603]
C73  0.1uF  [0402]
D5  PESD3V3L2BT,215  [SOT-23-3]
D6  NSPU3051N2T5G  [X2DFN-2(0.73-0.6x1.0x0.37)]
J5  310-87-104-41-001101  [4Pos, 1Row]
J6  GTFP08432B1HR  [microSD_Card_slot]
L1  4.7uH  [3.2 mm x 2.5 mm x 1 mm]
M1  DA14531MOD-00F01002  [DA14531MOD-00F01002]
R48  100kΩ  [0402]
R49  100Ω  [0402]
R50  100Ω  [0402]
R51  100Ω  [0402]
R52  100Ω  [0402]
R53  100Ω  [0402]
R54  100Ω  [0402]
TP21  TP-1.0  [Testpoint]  (no BOM)
TP22  TP-1.0  [Testpoint]  (no BOM)

### Nets
AVDD2: J5.2 M1.J7(VBAT)
DVDD: C72.2 D6.1(CATHODE) J6.4(VDD) L1.1
GND: C72.1 C73.1 D5.3 D6.2(ANODE) J5.1 J6.6(VSS) J6.10(SHIELD) J6.11(SHIELD) J6.12(SHIELD) M1.J1(GND) M1.J2(GND) M1.J3(GND) M1.J4(GND) M1.J6(GND) M1.J11(GND) M1.J16(P0_8) R48.1
BLE_RST: M1.J12(P0_0/RST) R48.2 ; off-sheet BLE_RST
BLE_RX: R49.2 ; off-sheet BLE_RX
BLE_SWCLK: D5.1 J5.4 M1.J10(P0_2/SWCLK) ; off-sheet BLE_SWCLK
BLE_SWDIO: D5.2 J5.3 M1.J9(P0_10/SWDIO) ; off-sheet BLE_SWDIO
BLE_TX: R50.2 ; off-sheet BLE_TX
SD_#CS: R51.2 TP21.1 ; off-sheet SD_#CS
SD_DIN: R52.2 ; off-sheet SD_DIN
SD_DOUT: R54.2 ; off-sheet SD_DOUT
SD_SCK: R53.2 TP22.1 ; off-sheet SD_SCK
NetC73_2: C73.2 L1.2
NetJ6_2: J6.2(CD/DAT3) R51.1
NetJ6_3: J6.3(DI/CMD) R52.1
NetJ6_5: J6.5(CLK) R53.1
NetJ6_7: J6.7(DO/DAT0) R54.1
NetM1_J13: M1.J13(P0_7) R49.1
NetM1_J14: M1.J14(P0_5) R50.1

Not connected (* = marked no-connect by the designer): J6 1(DATA2)* 8(DAT1)* 9(DETECT)*; M1 J5(P0_6)* J8(P0_11)* J15(P0_9)*

### Notes on the sheet
- BLE Module
- BLE Connector (SWD)
- (Force UART_CTS pin to be low.)
- MicroSD Module
- BLE Module, MicroSD Card Socket

### Library data of the parts
C72 = 0603: MLCC-0603
C73 = 0402: MLCC-0402
D5 = PESD3V3L2BT,215: as D2 on sheet Audio
D6 = NSPU3051N2T5G: as D1 on sheet PowerSupply
J5 = 310-87-104-41-001101: Headers & Wire Housings, Through Hole, 4 Poisition, 1 Row, Straight, Pitch 2.54 mm
J6 = GTFP08432B1HR: 0023-23-MMC-02-GTFP08432B1HR
L1 = SRP3212: SRP3212 Series Shielded Power Inductors, Wirewound
M1 = DA14531MOD-00F01002: 0038-15-BLT-07-DA14531MOD-00F01002
R48-R54 = 0402: Resistor_SMD_0402; AuthorBy: yjlab
TP21 TP22 = Testpoint

## Nets that join several sheets
AVDD1: PowerSupply (5 pins), HeartSound_LungSound (9 pins), Audio (5 pins)
AVDD2: PowerSupply (C12.2 TP4.1 U5.1), HeartSound_LungSound (6 pins), ECG (5 pins), Module (J5.2 M1.J7)
AVSS: PowerSupply (C17.2 R6.2 TP6.1 U7.5), HeartSound_LungSound (12 pins)
DVDD: PowerSupply (C9.2 TP2.1 U4.7), HeartSound_LungSound (C39.2 C40.2 U12.18), ECG (C58.2 C59.2 U15.23), Microcontroller (13 pins), Peripherals (C70.1 R44.2 SW1.2 SW1.2'), Module (C72.2 D6.1 J6.4 L1.1)
GND: PowerSupply (43 pins), HeartSound_LungSound (20 pins), Audio (8 pins), ECG (19 pins), Microcontroller (17 pins), Peripherals (6 pins), Module (17 pins)
STM_#RESET: PowerSupply (R1.1), Peripherals (C71.2 R45.2)
V_HL: HeartSound_LungSound (C34.1 U11.9 U12.5), Audio (U13.3)